# Altium project 1RGB-LED-Board_CR12xx.PrjPCB
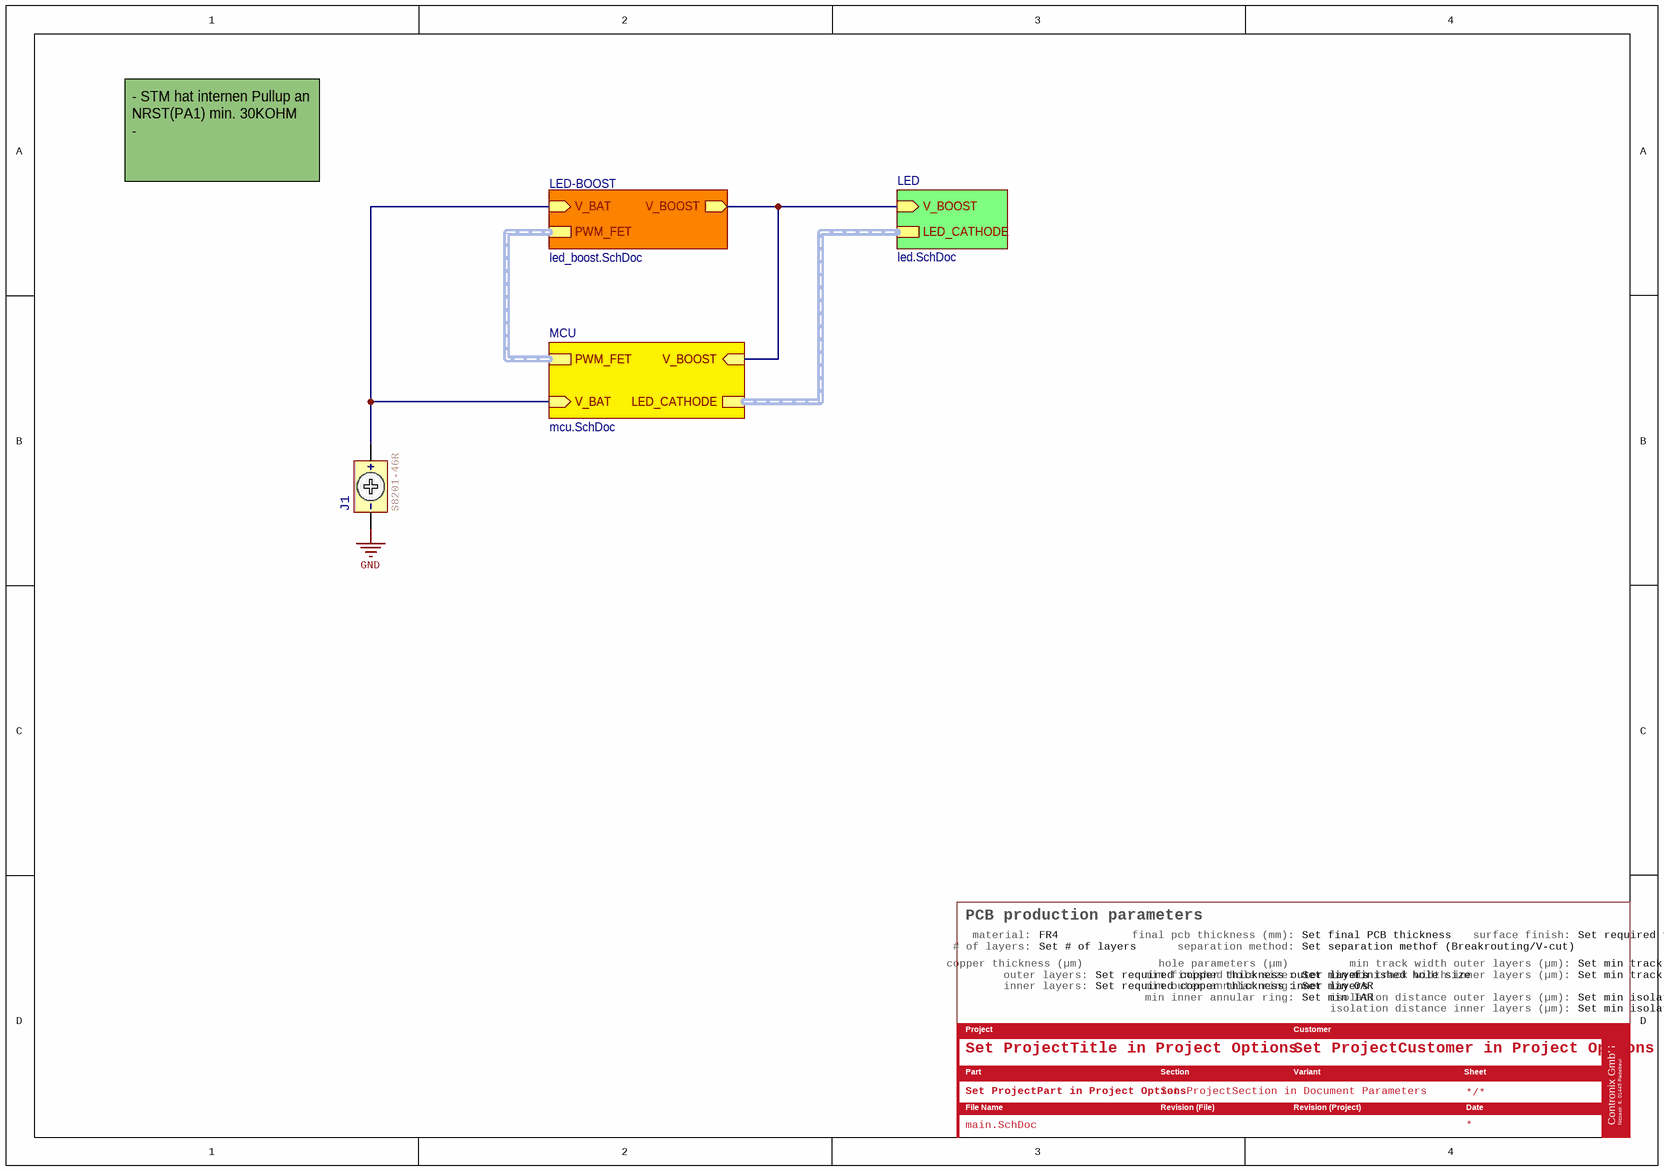
[diagram p0: main.SchDoc]
PCBCopperIL: Set required copper thickness inner layers; PCBCopperOL: Set required copper thickness outer layers; PCBFinish: Set required finished; PCBHoleSize: Set min finished hole size; PCBIsolationIL: Set min isolation IL; PCBIsolationOL: Set min isolation OL; PCBMaterial: FR4; PCBMinIAR: Set min IAR; PCBMinOAR: Set min OAR; PCBNumLayers: Set # of layers; PCBSeparation: Set separation methof (Breakrouting/V-cut); PCBThickness: Set final PCB thickness; PCBTrackWidthIL: Set min track width IL; PCBTrackWidthOL: Set min track width OL; ProjectCustomer: Set ProjectCustomer in Project Options; ProjectPart: Set ProjectPart in Project Options; ProjectTitle: Set ProjectTitle in Project Options
4 sheets, 20 parts. Net scope: hierarchical (ports join the sheet entries above them; power ports are global).
Board file: 1RGB-LED-Board_CR12xx.PcbDoc
Sheets:
  main.SchDoc
    MCU = mcu.SchDoc
    LED = led.SchDoc
    LED-BOOST = led_boost.SchDoc

## Sheet main.SchDoc
size 292 x 204 mm; ProjectSection: Set ProjectSection in Document Parameters; PageSetup: Record=PageOptions|CenterHorizontal=True|CenterVertical=True|PrintScale=1.00|XCorrection=1.00|YCorrection=1.00|PrintKind=1|BorderSize=5000000|LeftOffset=0|BottomOffset=0|Orientation=2|PaperLength=1000|PaperWidth=1000|Scale=100|PaperSource=7|PrintQuality=1200|MediaType=1|DitherType=10|PaperKind=A4|PrintScaleMode=1

### Parts
J1  Manufacturer P/N: S8201-46R  [BAT-CR1225-SMD-HARWIN]  (hidden comment: BAT-COIN)

### Sub-sheets
LED = led.SchDoc: V_BOOST (in), LED_CATHODE (harness LED_CATHODE)
LED-BOOST = led_boost.SchDoc: PWM_FET (harness PWM_FET), V_BAT (in), V_BOOST (out)
MCU = mcu.SchDoc: V_BAT (in), LED_CATHODE (harness LED_CATHODE), PWM_FET (harness PWM_FET), V_BOOST (in)

### Nets
GND: J1.2(-)
V_BAT: J1.1(+) ; sheet MCU/V_BAT, sheet LED-BOOST/V_BAT
V_BOOST: sheet MCU/V_BOOST, sheet LED/V_BOOST, sheet LED-BOOST/V_BOOST

### Buses and harness runs
harness sheet LED-BOOST/PWM_FET = sheet MCU/PWM_FET
harness sheet LED/LED_CATHODE = sheet MCU/LED_CATHODE

### Notes on the sheet
- - STM hat internen Pullup an NRST(PA1) min. 30KOHM
  -
- PCB production parameters
- # of layers:
- material:
- copper thickness (µm)
- outer layers:
- hole parameters (µm)
- final pcb thickness (mm):
- min finished hole size:
- separation method:
- surface finish:
- min track width outer layers (µm):
- min track width inner layers (µm):
- Project
- inner layers:
- Customer
- min outer annular ring:
- min inner annular ring:
- isolation distance outer layers (µm):
- isolation distance inner layers (µm):
- File Name
- Part
- Section
- Revision (File)
- Variant
- Revision (Project)
- Date
- Sheet
- Contronix GmbH
- Nizzastr. 6, 01445 Radebeul

### Library data of the parts
J1 = BAT-CR1225-SMD-HARWIN: CR1216 1225 Battery Holder SMT; Manufacturer: Harwin; hasAltManufacturer: 0; Contronix P/N: JWVM9H; NumberOfPins: 2; NumberOfRows: 1; Rev: =VersionControl_RevNumber; Design Item Id: BAT-CR1225-SMD-HARWIN; Price: 0,57; Price (€): 0,57; ComponentLink1Description: Manufacturer Drawing; ComponentLink1URL: https://cdn.harwin.com/pdfs/S8201R.pdf; Supplier 1: Digi-Key; Supplier Part Number 1: 952-1662-1-ND; Supplier 2: Mouser; Supplier Part Number 2: 855-S8201-46R; Created: 21.09.2020 18:54:32; Modified: 21.09.2020 18:54:32; Obsolete: 0; Type: Battery Holder; MountingType: SMT; Manufacturer Part Number: S8201-46R

## Sheet mcu.SchDoc
size 292 x 204 mm; ProjectSection: Set ProjectSection in Document Parameters; PageSetup: Record=PageOptions|CenterHorizontal=True|CenterVertical=True|PrintScale=1.00|XCorrection=1.00|YCorrection=1.00|PrintKind=1|BorderSize=5000000|LeftOffset=0|BottomOffset=0|Orientation=2|PaperLength=1000|PaperWidth=1000|Scale=100|PaperSource=7|PrintQuality=1200|MediaType=1|DitherType=10|PaperKind=A4|PrintScaleMode=1
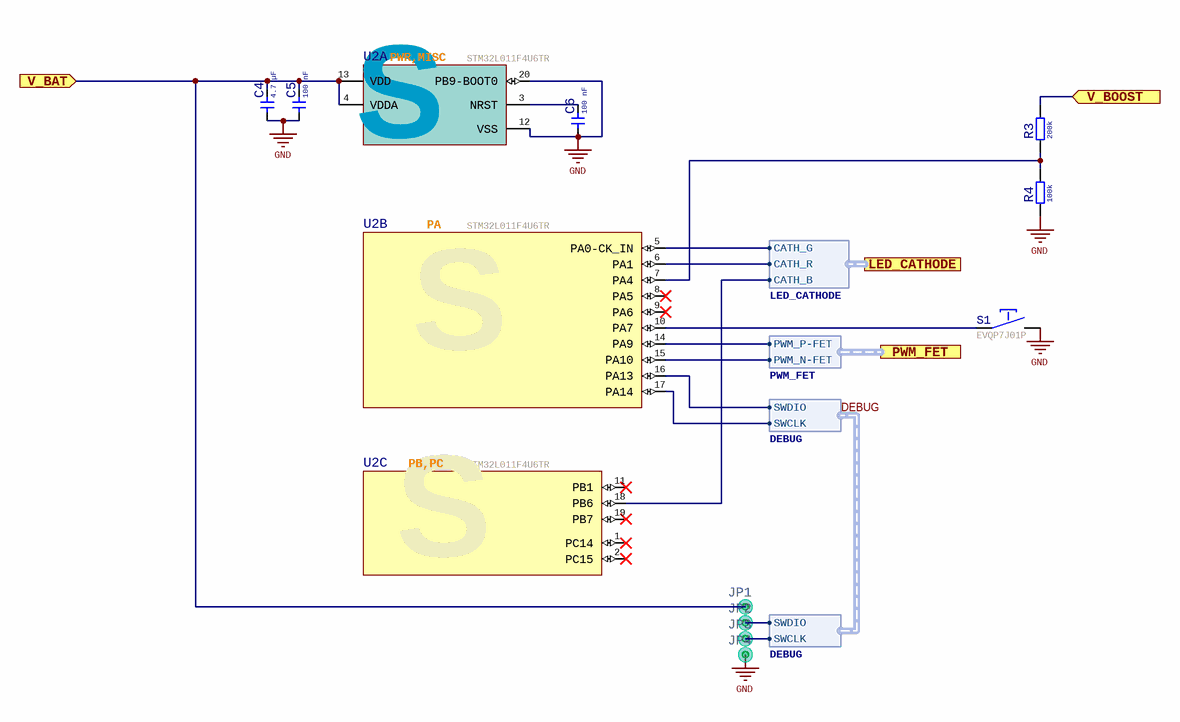
[diagram p1: mcu.SchDoc]

### Parts
C4  value 4.7 µF  [1608C]  (hidden comment: CAP-NP)
C5  value 100 nF  [1005C]  (hidden comment: CAP-NP)
C6  value 100 nF  [1005C]  (hidden comment: CAP-NP)
JP1  CON-01-TESTPOINT  [CON-01-PAD-0.75MM-RND]  (value not drawn)  (no BOM)
JP2  CON-01-TESTPOINT  [CON-01-PAD-0.75MM-RND]  (value not drawn)  (no BOM)
JP3  CON-01-TESTPOINT  [CON-01-PAD-0.75MM-RND]  (value not drawn)  (no BOM)
JP4  CON-01-TESTPOINT  [CON-01-PAD-0.75MM-RND]  (value not drawn)  (no BOM)
R3  value 200k  [1005R]  (hidden comment: RES)
R4  value 100k  [1005R]  (hidden comment: RES)
S1  Manufacturer P/N: EVQP7J01P  [SWI-PU-EVQP7x01P-Panasonic]  (hidden comment: SWI-PU)
U2  Manufacturer P/N: STM32L011F4U6TR  [IC-STM32L011FxUx-UFQFPN20]  (hidden comment: STM32L011FxUx)  (parts A,B,C of 3)

### Ports
LED_CATHODE (harness LED_CATHODE), PWM_FET (harness PWM_FET), V_BAT (in), V_BOOST (in)

### Harnesses
LED_CATHODE: CATH_R, CATH_B, CATH_G
PWM_FET: PWM_P-FET, PWM_N-FET
DEBUG: SWDIO, SWCLK

### Nets
GND: C4.1 C5.1 C6.1 JP4.1 R4.1 S1.2 U2.12(VSS) U2.20(PB9-BOOT0)
DEBUG.SWCLK: JP3.1 U2.17(PA14) ; harness DEBUG.SWCLK
DEBUG.SWDIO: JP2.1 U2.16(PA13) ; harness DEBUG.SWDIO
V_BAT: C4.2 C5.2 JP1.1 U2.4(VDDA) U2.13(VDD) ; port V_BAT
V_BOOST: R3.2 ; port V_BOOST
NetC6_2: C6.2 U2.3(NRST)
NetD1_2: U2.18(PB6) ; port LED_CATHODE.CATH_B
NetD1_3: U2.5(PA0-CK_IN) ; port LED_CATHODE.CATH_G
NetD1_4: U2.6(PA1) ; port LED_CATHODE.CATH_R
NetR1_1: U2.14(PA9) ; port PWM_FET.PWM_P-FET
NetR2_2: U2.15(PA10) ; port PWM_FET.PWM_N-FET
NetR3_1: R3.1 R4.2 U2.7(PA4)
NetS1_1: S1.1 U2.10(PA7)

Not connected (* = marked no-connect by the designer): U2 1(PC14)* 2(PC15)* 8(PA5)* 9(PA6)* 11(PB1)* 19(PB7)*

### Notes on the sheet
- Project
- Customer
- File Name
- Part
- Section
- Revision (File)
- Variant
- Revision (Project)
- Date
- Sheet
- Contronix GmbH
- Nizzastr. 6, 01445 Radebeul
- (in symbol STM32L011F4U6, part A) PWR,MISC; S
- (in symbol STM32L011F4U6, part B) PA; S
- (in symbol STM32L011F4U6, part C) PB,PC; S

### Library data of the parts
C4 = CAP-4u7-6V3-10%-X5R-1608: SMD ceramic capacitor, X5R; Manufacturer: Kemet; Manufacturer P/N: C0603C475K9PACTU; hasAltManufacturer: 0; Contronix P/N: CVXZ75; autIdem: 255; NozzleType: 701/901; FeederType: Tape 8mm; FeederPitch: 4mm; NumberOfPins: 2; NumberOfRows: 1; Voltage: 6,3; Tolerance: 10%; PackageCNTX: 1608; CapacitanceSI: 4,7E-6; Design Item Id: CAP-4u7-6V3-10%-X5R-1608; Stock: 84; Price: 0,11; Price (€): 0,11; A I: 255; ComponentLink1Description: Manufacturer Datasheet; Supplier 1: Digi-Key; Supplier Part Number 1: 399-3482-1-ND; Created: 08.08.2013 14:56:01; Modified: 18.02.2020 17:38:33; Obsolete: 0; Voltage (V): 6,3; PackageManufacturer: 1608; Material: X5R; MountingType: SMT; polarized: 0; Manufacturer Part Number: C0603C475K9PACTU
C5 C6 = CAP-100n-6V3-10%-X7R-1005: SMD ceramic capacitor, X7R; Manufacturer: Samsung Electro-Mechanics America, Inc.; Manufacturer P/N: CL05B104KQ5NNNC; hasAltManufacturer: 0; Contronix P/N: CANCYL; autIdem: 255; NozzleType: 701/901; FeederType: Tape 8mm; FeederPitch: 2mm; NumberOfPins: 2; NumberOfRows: 1; Voltage: 6,3; Tolerance: 10%; PackageCNTX: 1005; CapacitanceSI: 1E-7; Design Item Id: CAP-100n-6V3-10%-X7R-1005; Stock: 2023; Price: 0,0034; Price (€): 0,0034; A I: 255; ComponentLink1Description: Manufacturer Datasheet; ComponentLink1URL: https://content.kemet.com/datasheets/KEM_C1002_X7R_SMD.pdf; Supplier 1: RS; Supplier Part Number 1: 8015145P; Created: 16.11.2015 10:28:12; Modified: 30.10.2019 13:11:15; Obsolete: 0; Voltage (V): 6,3; PackageManufacturer: 1005; Material: X7R; MountingType: SMT; polarized: 0; Manufacturer Part Number: CL05B104KQ5NNNC
JP1-JP4 = CON-01-PAD-0.75MM-RND: 0.75 mm Pad; hasAltManufacturer: 0; Contronix P/N: JTW3SH; Design Item Id: CON-01-PAD-0.75MM-RND; Price: 0; Price (€): 0; autIdem: 0; A I: 0; Created: 20.10.2015 12:13:56; Modified: 13.02.2020 13:28:49; Obsolete: 0
R3 = RES-200k-1%-1005: SMD resistor; Manufacturer: Samsung Electro-Mechanics America, Inc.; Manufacturer P/N: RC1005F204CS; hasAltManufacturer: 0; Contronix P/N: RWVK9S; autIdem: 255; NozzleType: 701/901; FeederType: Tape 8mm; FeederPitch: 2mm; PackageCNTX: 1005; NumberOfPins: 2; NumberOfRows: 1; ResistanceSI: 200000; Tolerance: 1%; Power: 0,063; Design Item Id: RES-200k-1%-1005; Stock: 865; Price: 0,013; Price (€): 0,013; A I: 255; ComponentLink1Description: Manufacturer Datasheet; ComponentLink1URL: http://www.samsungsem.com/global/support/library/product-catalog/__icsFiles/afieldfile/2015/01/12/CHIP_RESISTOR_150112_1.pdf; Supplier 1: Digi-Key; Supplier Part Number 1: 1276-3449-1-ND; Created: 17.06.2015 09:33:35; Modified: 08.10.2019 17:16:22; Obsolete: 0; PackageManufacturer: 1005; Resistance: 200k; MountingType: SMT; Manufacturer Part Number: RC1005F204CS
R4 = RES-100k-1%-0.063W-1005: SMD resistor; Manufacturer: Yageo; Manufacturer P/N: RC0402FR-07100KL; hasAltManufacturer: 0; Contronix P/N: R4P27U; autIdem: 255; NozzleType: 701/901; FeederType: Tape 8mm; FeederPitch: 2mm; PackageCNTX: 1005; NumberOfPins: 2; NumberOfRows: 1; ResistanceSI: 100000; Tolerance: 1%; Power: 0,063; Design Item Id: RES-100k-1%-0.063W-1005; Stock: 151; Price: 0,09; Price (€): 0,09; A I: 255; ComponentLink1Description: Manufacturer Datasheet; ComponentLink1URL: http://www.seielect.com/Catalog/SEI-RMC.pdf; Supplier 1: Mouser; Supplier Part Number 1: 603-RC0402FR-07100KL; Supplier 2: Digi-Key; Supplier Part Number 2: 311-100KLRCT-ND; Supplier 3: Digi-Key; Supplier Part Number 3: 311-100KLRCT-ND; Modified: 26.06.2020 15:46:35; Obsolete: 0; PackageManufacturer: 1005; Resistance: 100k; MountingType: SMT; Manufacturer Part Number: RC0402FR-07100KL
S1 = SWI-PU-EVQP7J01P-Panasonic: SMD Push Button, Right Angle; hasAltManufacturer: 0; Contronix P/N: SGUKDA; NumberOfPins: 4; NumberOfRows: 2; Design Item Id: SWI-PU-EVQP7J01P-Panasonic; Manufacturer: Panasonic; Stock: 0; Price: 0,28; Price (€): 0,28; Supplier 1: Mouser; Supplier Part Number 1: 667-EVQP7J01P; Supplier 2: Digi-Key; Supplier Part Number 2: P16767CT-ND; Created: 28.03.2018 19:53:29; Modified: 01.07.2020 16:17:19; Obsolete: 0; Type: Pushbutton SPST; MountingType: SMT; Manufacturer Part Number: EVQP7J01P
U2 = STM32L011F4U6: Ultra-low-power ARM Cortex-M0+ MCU with 16-Kbytes Flash, 32 MHz CPU; Manufacturer: ST Microelectronics; hasAltManufacturer: 0; Contronix P/N: UY5WXY; NozzleType: 711/911; FeederType: Tape 12mm; FeederPitch: 8mm; PackageCNTX: UFQFPN20; NumberOfPins: 20; NumberOfRows: 4; VoltageMin: 1,65; VoltageMax: 3,6; Flash: 16; RAM: 2; EEPROM: 512; I2C: 1; GPIOs: 28; ADCchannels: 10; ADCbits: 12; Rev: =VersionControl_RevNumber; Design Item Id: STM32L011F4U6; Stock: 3; Price: 1,4; Price (€): 1,4; ComponentLink1Description: Manufacturer Datasheet; ComponentLink1URL: http://www.st.com/content/ccc/resource/technical/document/datasheet/42/c0/ab/e5/71/7a/47/0b/DM00206508.pdf/files/DM00206508.pdf/jcr:content/translations/en.DM00206508.pdf; Supplier 1: Mouser; Supplier Part Number 1: 511-STM32L011F4U6TR; Supplier 2: Digi-Key; Supplier Part Number 2: 497-17478-1-ND; Created: 20.11.2017 15:08:31; Modified: 21.06.2018 19:27:00; Obsolete: 0; PackageManufacturer: UFQFPN20; Core: Cortex-M0+; USART: 1; SPI: 1; MountingType: SMT; Manufacturer Part Number: STM32L011F4U6TR

## Sheet led.SchDoc
size 292 x 204 mm; ProjectSection: Set ProjectSection in Document Parameters; PageSetup: Record=PageOptions|CenterHorizontal=True|CenterVertical=True|PrintScale=1.00|XCorrection=1.00|YCorrection=1.00|PrintKind=1|BorderSize=5000000|LeftOffset=0|BottomOffset=0|Orientation=2|PaperLength=1000|PaperWidth=1000|Scale=100|PaperSource=7|PrintQuality=1200|MediaType=1|DitherType=10|PaperKind=A4|PrintScaleMode=1
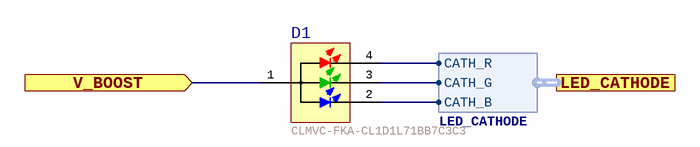
[diagram p2: led.SchDoc]

### Parts
D1  Manufacturer P/N: CLMVC-FKA-CL1D1L71BB7C3C3  [LED-RGB-PLCC4-2020-CLMVx-FKA]  (hidden comment: DIO-LED-RGB-CA-PIN1-CLMVx-FKA)

### Ports
LED_CATHODE (harness LED_CATHODE), V_BOOST (in)

### Harnesses
LED_CATHODE: CATH_R, CATH_B, CATH_G

### Nets
V_BOOST: D1.1(Anode) ; port V_BOOST
NetD1_2: D1.2(B) ; port LED_CATHODE.CATH_B
NetD1_3: D1.3(G) ; port LED_CATHODE.CATH_G
NetD1_4: D1.4(R) ; port LED_CATHODE.CATH_R

### Notes on the sheet
- Project
- Customer
- File Name
- Part
- Section
- Revision (File)
- Variant
- Revision (Project)
- Date
- Sheet
- Contronix GmbH
- Nizzastr. 6, 01445 Radebeul

### Library data of the parts
D1 = LED-RGB-CLMVC-FKA-PLCC4: RGB LED PLCC-4 2x2mm Common Anode; Manufacturer: Cree Inc; hasAltManufacturer: 0; Contronix P/N: DR7TDL; NozzleType: 711/911; FeederType: Tape 8mm; FeederPitch: 4mm; NumberOfPins: 4; NumberOfRows: 2; Design Item Id: LED-RGB-CLMVC-FKA-PLCC4; Stock: 15; Price: 0,17; Price (€): 0,17; ComponentLink1Description: Manufacturer Datasheet; ComponentLink1URL: https://www.cree.com/led-components/media/documents/1273-CLMVC-FKA.pdf; Supplier 1: Digi-Key; Supplier Part Number 1: CLMVC-FKA-CL1D1L71BB7C3C3CT-ND; Supplier 2: Mouser; Supplier Part Number 2: 941-CLMVCFKACL1D1L71; Created: 21.03.2018 20:33:27; Modified: 30.06.2020 13:58:57; Obsolete: 0; Color: RGB; isMulticolor: 0; MountingType: SMT; Manufacturer Part Number: CLMVC-FKA-CL1D1L71BB7C3C3

## Sheet led_boost.SchDoc
size 292 x 204 mm; ProjectSection: Set ProjectSection in Document Parameters; PageSetup: Record=PageOptions|CenterHorizontal=True|CenterVertical=True|PrintScale=1.00|XCorrection=1.00|YCorrection=1.00|PrintKind=1|BorderSize=5000000|LeftOffset=0|BottomOffset=0|Orientation=2|PaperLength=1000|PaperWidth=1000|Scale=100|PaperSource=7|PrintQuality=1200|MediaType=1|DitherType=10|PaperKind=A4|PrintScaleMode=1
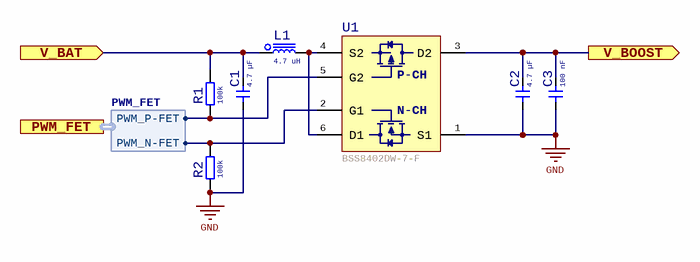
[diagram p3: led_boost.SchDoc]

### Parts
C1  value 4.7 µF  [1608C]  (hidden comment: CAP-NP)
C2  value 4.7 µF  [1608C]  (hidden comment: CAP-NP)
C3  value 100 nF  [1005C]  (hidden comment: CAP-NP)
L1  value 4.7 uH  [2012L]  (hidden comment: INDUCTOR)
R1  value 100k  [1005R]  (hidden comment: RES)
R2  value 100k  [1005R]  (hidden comment: RES)
U1  Manufacturer P/N: BSS8402DW-7-F  [TRANS-DUAL-SOT-363-6]  (hidden comment: TRANS-FET-DUAL-N-P-6PIN)

### Ports
PWM_FET (harness PWM_FET), V_BAT (in), V_BOOST (out)

### Harnesses
PWM_FET: PWM_P-FET, PWM_N-FET

### Nets
GND: C1.1 C2.1 C3.1 R2.1 U1.1(S1)
V_BAT: C1.2 L1.1 R1.2 ; port V_BAT
V_BOOST: C2.2 C3.2 U1.3(D2) ; port V_BOOST
NetL1_2: L1.2 U1.4(S2) U1.6(D1)
NetR1_1: R1.1 U1.5(G2) ; port PWM_FET.PWM_P-FET
NetR2_2: R2.2 U1.2(G1) ; port PWM_FET.PWM_N-FET

### Notes on the sheet
- Project
- Customer
- File Name
- Part
- Section
- Revision (File)
- Variant
- Revision (Project)
- Date
- Sheet
- Contronix GmbH
- Nizzastr. 6, 01445 Radebeul
- (in symbol TRANS-FET-DUAL-N-P-6PIN) P-CH; N-CH

### Library data of the parts
C1 C2 = CAP-4u7-6V3-10%-X5R-1608: as C4 on sheet mcu; Design Item Id: CAP-4u7-6V3-10%-X5R-1608; Stock: 84; Price: 0,11; Price (€): 0,11; A I: 255; ComponentLink1Description: Manufacturer Datasheet; Supplier 1: Digi-Key; Supplier Part Number 1: 399-3482-1-ND; Created: 08.08.2013 14:56:01; Modified: 18.02.2020 17:38:33; Obsolete: 0; Voltage (V): 6,3; PackageManufacturer: 1608; Material: X5R; MountingType: SMT; polarized: 0; Manufacturer Part Number: C0603C475K9PACTU
C3 = CAP-100n-6V3-10%-X7R-1005: as C5 on sheet mcu; Design Item Id: CAP-100n-6V3-10%-X7R-1005; Stock: 2023; Price: 0,0034; Price (€): 0,0034; A I: 255; ComponentLink1Description: Manufacturer Datasheet; ComponentLink1URL: https://content.kemet.com/datasheets/KEM_C1002_X7R_SMD.pdf; Supplier 1: RS; Supplier Part Number 1: 8015145P; Created: 16.11.2015 10:28:12; Modified: 30.10.2019 13:11:15; Obsolete: 0; Voltage (V): 6,3; PackageManufacturer: 1005; Material: X7R; MountingType: SMT; polarized: 0; Manufacturer Part Number: CL05B104KQ5NNNC
L1 = IND-4u7-0.8A-2012: Chip Inductor; Manufacturer: Murata Electronics; Manufacturer P/N: LQM21PN4R7NGRD; hasAltManufacturer: 0; Contronix P/N: LD7UG2; NozzleType: 711/911; FeederType: Tape 8mm; FeederPitch: 4mm; NumberOfPins: 2; NumberOfRows: 1; PackageCNTX: 2012; InductanceSI: 4,7E-6; Current: 0,8; Tolerance: 30%; Resistance: 0.288; Design Item Id: IND-4u7-0.8A-2012; Stock: 18; Price: 0,106; Price (€): 0,106; ComponentLink1Description: Manufacturer Datasheet; ComponentLink1URL: http://search.murata.co.jp/Ceramy/image/img/P02/JELF243B-0026.pdf; Supplier 1: Digi-Key; Supplier Part Number 1: 490-7782-1-ND; Supplier 2: Mouser; Supplier Part Number 2: 81-LQM21PN4R7NGRDRD; Created: 09.11.2017 14:17:36; Modified: 14.11.2018 11:06:53; Obsolete: 0; PackageManufacturer: 2012; Inductance: 4.7 uH; MountingType: SMT; Manufacturer Part Number: LQM21PN4R7NGRD
R1 R2 = RES-100k-1%-0.063W-1005: as R4 on sheet mcu; Design Item Id: RES-100k-1%-0.063W-1005; Stock: 151; Price: 0,09; Price (€): 0,09; A I: 255; ComponentLink1Description: Manufacturer Datasheet; ComponentLink1URL: http://www.seielect.com/Catalog/SEI-RMC.pdf; Supplier 1: Mouser; Supplier Part Number 1: 603-RC0402FR-07100KL; Supplier 2: Digi-Key; Supplier Part Number 2: 311-100KLRCT-ND; Supplier 3: Digi-Key; Supplier Part Number 3: 311-100KLRCT-ND; Modified: 26.06.2020 15:46:35; Obsolete: 0; PackageManufacturer: 1005; Resistance: 100k; MountingType: SMT; Manufacturer Part Number: RC0402FR-07100KL
U1 = TRANS-FET-DUAL-N-P-6PIN: N and P-Channel MOSFET; Manufacturer: Diodes Inc.; hasAltManufacturer: 0; Manufacturer Part Number: DMC2041UFDB; Contronix P/N: QBSP7Z; NozzleType: 711/911; FeederType: Tape 8mm; FeederPitch: 4mm; PackageCNTX: U-DFN2020-6; NumberOfPins: 6; NumberOfRows: 2; Voltage: 20; Current: 4,7; Stratification: P- and N-Channel; Rev: =VersionControl_RevNumber; Design Item Id: TRANS-FET-DUAL-N-P-20V-4.7A-3.2A-DMC2041-DFN2020; Stock: 0; Price: 0,672; Price (€): 0,672; ComponentLink1Description: Manufacturer Datasheet; ComponentLink1URL: https://www.diodes.com/assets/Datasheets/DMC2041UFDB.pdf; Supplier 1: Mouser; Supplier Part Number 1: 621-DMC2041UFDB-7; Supplier 2: Digi-Key; Supplier Part Number 2: DMC2041UFDB-7DICT-ND; Created: 13.02.2018 12:07:42; Modified: 13.09.2019 15:59:32; Obsolete: 0; PackageManufacturer: U-DFN2020-6; Voltage (V): 20; Type: MOSFET Enh.; MountingType: SMT

## Nets that join several sheets
GND: main (J1.2), mcu (8 pins), led_boost (5 pins)
NetD1_2: mcu (U2.18), led (D1.2)
NetD1_3: mcu (U2.5), led (D1.3)
NetD1_4: mcu (U2.6), led (D1.4)
NetR1_1: mcu (U2.14), led_boost (R1.1 U1.5)
NetR2_2: mcu (U2.15), led_boost (R2.2 U1.2)
V_BAT: main (J1.1), mcu (5 pins), led_boost (C1.2 L1.1 R1.2)
V_BOOST: mcu (R3.2), led (D1.1), led_boost (C2.2 C3.2 U1.3)